# EAGLE design fri3d-badge-2018 (EAGLE 8.6.0)
CNAME: Fri3d Camp Badge; CREVISION: 2.0; DESIGNER: Christophe VG

## Sheet 1 of 2
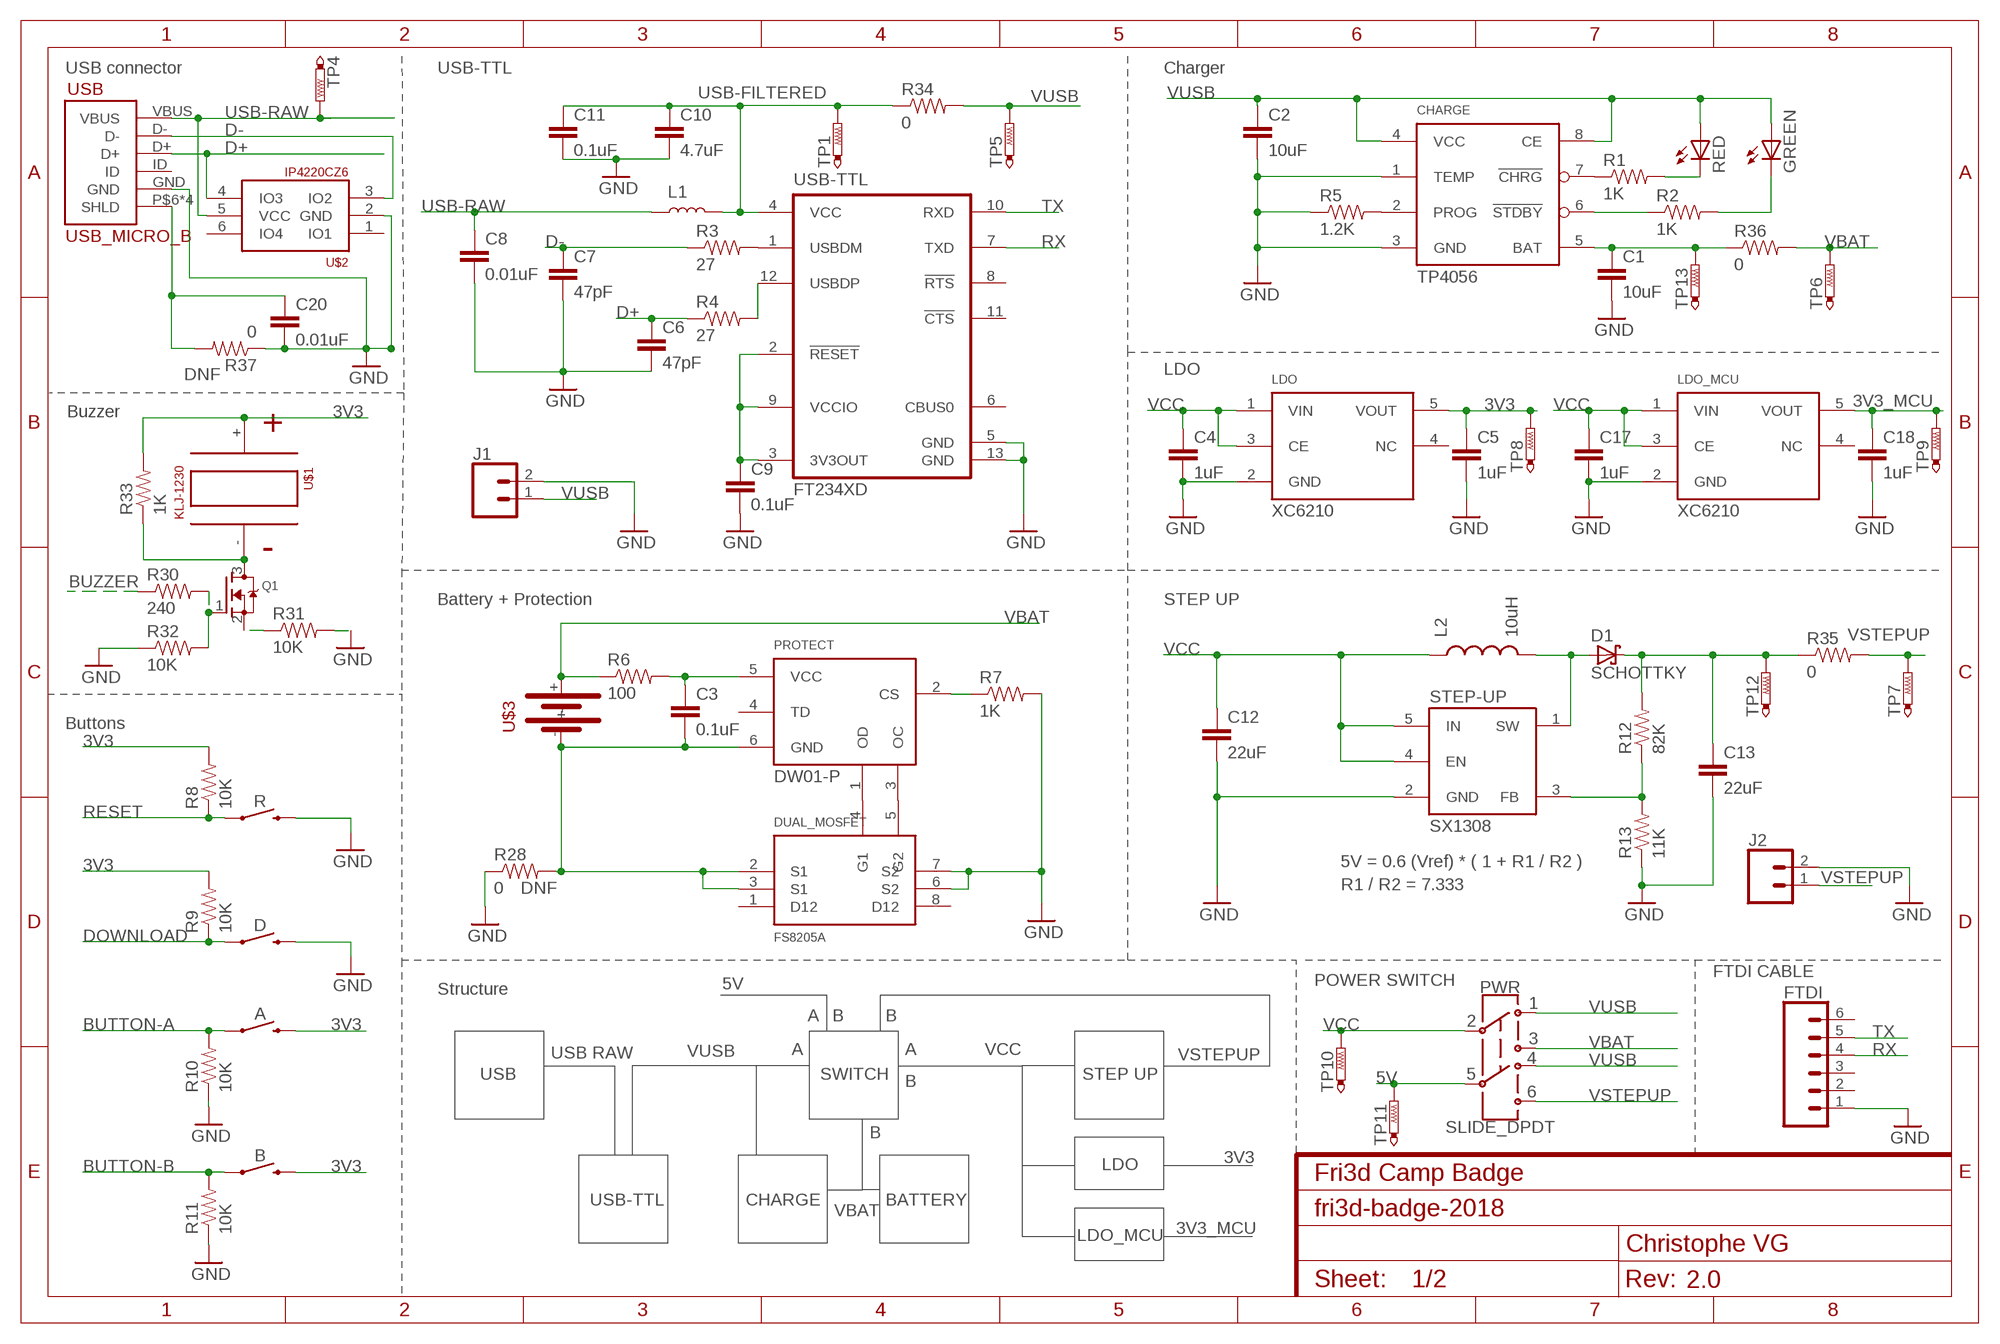
[diagram p0: schematic, sheet 1]

### Parts
A  SWITCH-MOMENTARY-4.5MM  [SWITCH-MOMENTARY-4.5MM]
B  SWITCH-MOMENTARY-4.5MM  [SWITCH-MOMENTARY-4.5MM]
C1  10uF  CAP0805  [0805]
C2  10uF  CAP0805  [0805]
C3  0.1uF  CAP0805  [0805]
C4  1uF  CAP0805  [0805]
C5  1uF  CAP0805  [0805]
C6  47pF  CAP0805  [0805]
C7  47pF  CAP0805  [0805]
C8  0.01uF  CAP0805  [0805]
C9  0.1uF  CAP0805  [0805]
C10  4.7uF  CAP0805  [0805]
C11  0.1uF  CAP0805  [0805]
C12  22uF  CAP0805  [0805]
C13  22uF  CAP0805  [0805]
C17  1uF  CAP0805  [0805]
C18  1uF  CAP0805  [0805]
C20  0.01uF  CAP0805  [0805]
CHARGE  TP4056  [SO8]
D  SWITCH-MOMENTARY-4.5MM  [SWITCH-MOMENTARY-4.5MM]
D1  SCHOTTKY  [SOD993]
DUAL_MOSFET  FS8205A  [TSSOP8]
FTDI  CONN_06SILK_FEMALE_PTH  [1X06]
GREEN  LEDCHIP-LED0805  [CHIP-LED0805]
J1  CONN_02  [1X02]
J2  CONN_02  [1X02]
L1  INDUCTOR-0805-3.3UH  [0805]
L2  10uH  TYS6045100M-10  [TYS6045]
LDO  XC6210  [SOT23-5]
LDO_MCU  XC6210  [SOT23-5]
PROTECT  DW01-P  [SOT23-6]
PWR  SLIDE_DPDT  [SLIDE_SWITCH]
Q1  MOSFET-NREFLOW  [SOT23]
R  SWITCH-MOMENTARY-4.5MM  [SWITCH-MOMENTARY-4.5MM]
R1  1K  RESISTOR0805-RES  [0805]
R2  1K  RESISTOR0805-RES  [0805]
R3  27  RESISTOR0805-RES  [0805]
R4  27  RESISTOR0805-RES  [0805]
R5  1.2K  RESISTOR0805-RES  [0805]
R6  100  RESISTOR0805-RES  [0805]
R7  1K  RESISTOR0805-RES  [0805]
R8  10K  RESISTOR0805-RES  [0805]
R9  10K  RESISTOR0805-RES  [0805]
R10  10K  RESISTOR0805-RES  [0805]
R11  10K  RESISTOR0805-RES  [0805]
R12  82K  RESISTOR0805-RES  [0805]
R13  11K  RESISTOR0805-RES  [0805]
R28  0  RESISTOR0805-RES  [0805]
R30  240  RESISTOR0805-RES  [0805]
R31  10K  RESISTOR0805-RES  [0805]
R32  10K  RESISTOR0805-RES  [0805]
R33  1K  RESISTOR0805-RES  [0805]
R34  0  RESISTOR0805-RES  [0805]
R35  0  RESISTOR0805-RES  [0805]
R36  0  RESISTOR0805-RES  [0805]
R37  0  RESISTOR0805-RES  [0805]
RED  LEDCHIP-LED0805  [CHIP-LED0805]
STEP-UP  SX1308  [SOT23-6]
TP1  PTR1B1,27  [B1,27]
TP4  PTR1B1,27  [B1,27]
TP5  PTR1B1,27  [B1,27]
TP6  PTR1B1,27  [B1,27]
TP7  PTR1B1,27  [B1,27]
TP8  PTR1B1,27  [B1,27]
TP9  PTR1B1,27  [B1,27]
TP10  PTR1B1,27  [B1,27]
TP11  PTR1B1,27  [B1,27]
TP12  PTR1B1,27  [B1,27]
TP13  PTR1B1,27  [B1,27]
U$1  KLJ-1230  [KLJ-1230]
U$2  IP4220CZ6  [SOT457R_PHILIPS]
U$3  CR18650  [BATTERY_HOLDER_18650]
USB  USB_MICRO_B  [USB_MICRO_B]
USB-TTL  FT234XD  [DFN12]

### Nets
3V3: A.3 A.4 B.3 B.4 C5.1 LDO.5(VOUT) R8.2 R9.2 R33.2 TP8.TP U$1.+ ; also sheet 2
3V3_MCU: C18.1 LDO_MCU.5(VOUT) TP9.TP ; also sheet 2
5V: PWR.5 TP11.TP ; also sheet 2
BUTTON-A: A.1 A.2 R10.2 ; also sheet 2
BUTTON-B: B.1 B.2 R11.2 ; also sheet 2
BUZZER: R30.1 ; also sheet 2
D+: C6.1 R4.1 U$2.4(IO3) USB.D+
D-: C7.1 R3.1 U$2.3(IO2) USB.D-
DOWNLOAD: D.1 D.2 R9.1 ; also sheet 2
GND: C1.2 C2.2 C4.2 C5.2 C6.2 C7.2 C8.2 C9.2 C10.2 C11.2 C12.2 C13.2 C17.2 C18.2 C20.2 CHARGE.1(TEMP) CHARGE.3(GND) D.3 D.4 DUAL_MOSFET.6(S2) DUAL_MOSFET.7(S2) FTDI.1 J1.2 J2.2 LDO.2(GND) LDO_MCU.2(GND) R5.1 R7.2 R10.1 R11.1 R13.1 R28.1 R31.2 R32.1 R37.1 R.3 R.4 STEP-UP.2(GND) U$2.2(GND) USB-TTL.5(GND) USB-TTL.13(GND) USB.GND ; also sheet 2
N$1: C13.1 D1.P$2(C) R12.2 R35.1 TP12.TP
N$2: Q1.3(D) R33.1 U$1.-
N$3: R3.2 USB-TTL.1(USBDM)
N$4: CHARGE.7(!CHRG!) R1.1
N$5: R4.2 USB-TTL.12(USBDP)
N$6: C9.1 USB-TTL.2(!RESET!) USB-TTL.3(3V3OUT) USB-TTL.9(VCCIO)
N$7: CHARGE.6(!STDBY!) R2.1
N$8: R1.2 RED.C
N$9: GREEN.C R2.2
N$10: CHARGE.2(PROG) R5.2
N$11: Q1.1(G) R30.2 R32.2
N$12: PROTECT.2(CS) R7.1
N$13: C3.1 PROTECT.5(VCC) R6.2
N$14: DUAL_MOSFET.4(G1) PROTECT.1(OD)
N$15: DUAL_MOSFET.5(G2) PROTECT.3(OC)
N$18: R12.1 R13.2 STEP-UP.3(FB)
N$19: D1.P$1(A) L2.P$2 STEP-UP.1(SW)
N$22: C1.1 CHARGE.5(BAT) R36.1 TP13.TP
N$23: C20.1 R37.2 USB.P$6(SHLD) USB.P$7(SHLD) USB.P$8(SHLD) USB.P$9(SHLD)
N$62: C3.2 DUAL_MOSFET.2(S1) DUAL_MOSFET.3(S1) PROTECT.6(GND) R28.2 U$3.-
N$63: Q1.2(S) R31.1
RESET: R8.1 R.1 R.2 ; also sheet 2
RX: FTDI.4 USB-TTL.7(TXD) ; also sheet 2
TX: FTDI.5 USB-TTL.10(RXD) ; also sheet 2
USB-FILTERED: C10.1 C11.1 L1.2 R34.1 TP1.TP USB-TTL.4(VCC)
USB-RAW: C8.1 L1.1 TP4.TP U$2.5(VCC) USB.VBUS
VBAT: PWR.3 R6.1 R36.2 TP6.TP U$3.+
VCC: C4.1 C12.1 C17.1 L2.P$1 LDO.1(VIN) LDO.3(CE) LDO_MCU.1(VIN) LDO_MCU.3(CE) PWR.2 STEP-UP.4(EN) STEP-UP.5(IN) TP10.TP
VSTEPUP: J2.1 PWR.4 R35.2 TP7.TP
VUSB: C2.1 CHARGE.4(VCC) CHARGE.8(CE) GREEN.A J1.1 PWR.1 PWR.8 R34.2 RED.A TP5.TP
Unconnected: DUAL_MOSFET.1(D12) DUAL_MOSFET.8(D12) FTDI.2 FTDI.3 FTDI.6 LDO.4(NC) LDO_MCU.4(NC) PROTECT.4(TD) U$2.1(IO1) U$2.6(IO4) USB-TTL.6(CBUS0) USB-TTL.8(!RTS!) USB-TTL.11(!CTS!) USB.ID

### Notes on the sheet
- USB connector | USB-TTL | Charger
- LDO
- DNF
- Buzzer
- Battery + Protection | STEP UP
- Buttons
- 5V = 0.6 (Vref) * ( 1 + R1 / R2 )
- DNF | R1 / R2 = 7.333
- FTDI CABLE
- 5V | POWER SWITCH
- Structure
- A | B | B
- USB RAW | VUSB | A | A | VCC
- VSTEPUP
- USB | SWITCH | STEP UP
- B
- B
- 3V3
- LDO
- USB-TTL | CHARGE | BATTERY
- VBAT
- 3V3_MCU
- LDO_MCU

## Sheet 2 of 2
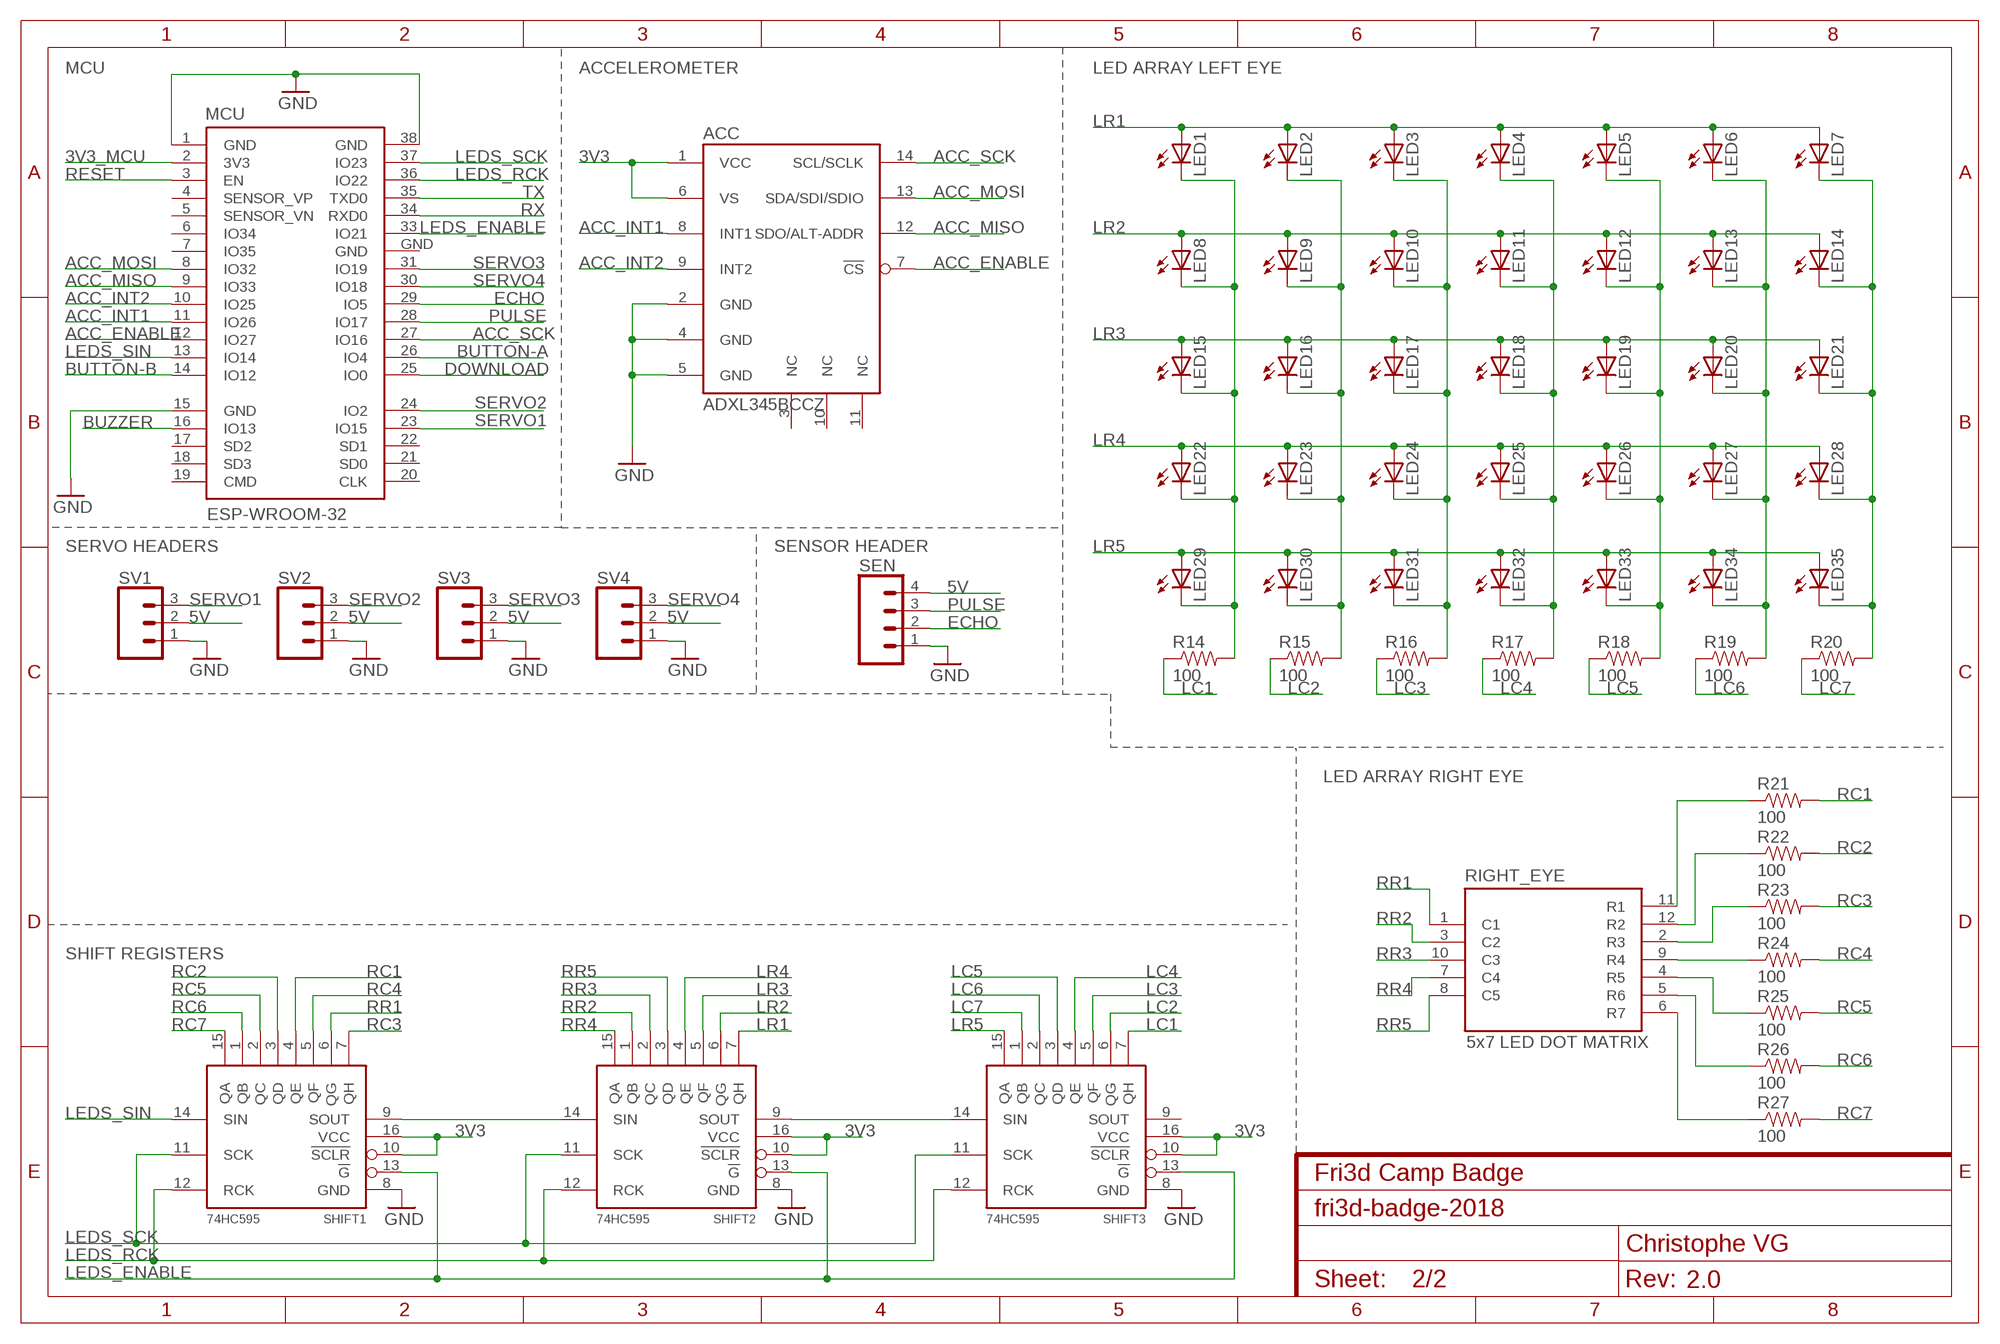
[diagram p1: schematic, sheet 2]

### Parts
ACC  ADXL345BCCZ  [LGA]
LED1  LEDCHIP-LED0805  [CHIP-LED0805]
LED2  LEDCHIP-LED0805  [CHIP-LED0805]
LED3  LEDCHIP-LED0805  [CHIP-LED0805]
LED4  LEDCHIP-LED0805  [CHIP-LED0805]
LED5  LEDCHIP-LED0805  [CHIP-LED0805]
LED6  LEDCHIP-LED0805  [CHIP-LED0805]
LED7  LEDCHIP-LED0805  [CHIP-LED0805]
LED8  LEDCHIP-LED0805  [CHIP-LED0805]
LED9  LEDCHIP-LED0805  [CHIP-LED0805]
LED10  LEDCHIP-LED0805  [CHIP-LED0805]
LED11  LEDCHIP-LED0805  [CHIP-LED0805]
LED12  LEDCHIP-LED0805  [CHIP-LED0805]
LED13  LEDCHIP-LED0805  [CHIP-LED0805]
LED14  LEDCHIP-LED0805  [CHIP-LED0805]
LED15  LEDCHIP-LED0805  [CHIP-LED0805]
LED16  LEDCHIP-LED0805  [CHIP-LED0805]
LED17  LEDCHIP-LED0805  [CHIP-LED0805]
LED18  LEDCHIP-LED0805  [CHIP-LED0805]
LED19  LEDCHIP-LED0805  [CHIP-LED0805]
LED20  LEDCHIP-LED0805  [CHIP-LED0805]
LED21  LEDCHIP-LED0805  [CHIP-LED0805]
LED22  LEDCHIP-LED0805  [CHIP-LED0805]
LED23  LEDCHIP-LED0805  [CHIP-LED0805]
LED24  LEDCHIP-LED0805  [CHIP-LED0805]
LED25  LEDCHIP-LED0805  [CHIP-LED0805]
LED26  LEDCHIP-LED0805  [CHIP-LED0805]
LED27  LEDCHIP-LED0805  [CHIP-LED0805]
LED28  LEDCHIP-LED0805  [CHIP-LED0805]
LED29  LEDCHIP-LED0805  [CHIP-LED0805]
LED30  LEDCHIP-LED0805  [CHIP-LED0805]
LED31  LEDCHIP-LED0805  [CHIP-LED0805]
LED32  LEDCHIP-LED0805  [CHIP-LED0805]
LED33  LEDCHIP-LED0805  [CHIP-LED0805]
LED34  LEDCHIP-LED0805  [CHIP-LED0805]
LED35  LEDCHIP-LED0805  [CHIP-LED0805]
MCU  ESP-WROOM-32  [ESP-WROOM-32]
R14  100  RESISTOR0805-RES  [0805]
R15  100  RESISTOR0805-RES  [0805]
R16  100  RESISTOR0805-RES  [0805]
R17  100  RESISTOR0805-RES  [0805]
R18  100  RESISTOR0805-RES  [0805]
R19  100  RESISTOR0805-RES  [0805]
R20  100  RESISTOR0805-RES  [0805]
R21  100  RESISTOR0805-RES  [0805]
R22  100  RESISTOR0805-RES  [0805]
R23  100  RESISTOR0805-RES  [0805]
R24  100  RESISTOR0805-RES  [0805]
R25  100  RESISTOR0805-RES  [0805]
R26  100  RESISTOR0805-RES  [0805]
R27  100  RESISTOR0805-RES  [0805]
RIGHT_EYE  5x7 LED DOT MATRIX  5X7_DOT_LED_MATRIX  [5X7_DOT_LED_MATRIX]
SEN  CONN_04  [1X04]
SHIFT1  74HC595  [SO16]
SHIFT2  74HC595  [SO16]
SHIFT3  74HC595  [SO16]
SV1  CONN_03  [1X03]
SV2  CONN_03  [1X03]
SV3  CONN_03  [1X03]
SV4  CONN_03  [1X03]

### Nets
3V3: ACC.1(VCC) ACC.6(VS) SHIFT1.10(!SCLR) SHIFT1.16(VCC) SHIFT2.10(!SCLR) SHIFT2.16(VCC) SHIFT3.10(!SCLR) SHIFT3.16(VCC) ; also sheet 1
3V3_MCU: MCU.2(3V3) ; also sheet 1
5V: SEN.4 SV1.2 SV2.2 SV3.2 SV4.2 ; also sheet 1
ACC_ENABLE: ACC.7(!CS!) MCU.12(IO27)
ACC_INT1: ACC.8(INT1) MCU.11(IO26)
ACC_INT2: ACC.9(INT2) MCU.10(IO25)
ACC_MISO: ACC.12(SDO/ALT-ADDR) MCU.9(IO33)
ACC_MOSI: ACC.13(SDA/SDI/SDIO) MCU.8(IO32)
ACC_SCK: ACC.14(SCL/SCLK) MCU.27(IO16)
BUTTON-A: MCU.26(IO4) ; also sheet 1
BUTTON-B: MCU.14(IO12) ; also sheet 1
BUZZER: MCU.16(IO13) ; also sheet 1
DOWNLOAD: MCU.25(IO0) ; also sheet 1
ECHO: MCU.29(IO5) SEN.2
GND: ACC.2(GND) ACC.4(GND) ACC.5(GND) MCU.1(GND) MCU.15(GND) MCU.38(GND) SEN.1 SHIFT1.8(GND) SHIFT2.8(GND) SHIFT3.8(GND) SV1.1 SV2.1 SV3.1 SV4.1 ; also sheet 1
LC1: R14.1 SHIFT3.7(QH)
LC2: R15.1 SHIFT3.6(QG)
LC3: R16.1 SHIFT3.5(QF)
LC4: R17.1 SHIFT3.4(QE)
LC5: R18.1 SHIFT3.3(QD)
LC6: R19.1 SHIFT3.2(QC)
LC7: R20.1 SHIFT3.1(QB)
LEDS_ENABLE: MCU.33(IO21) SHIFT1.13(!G) SHIFT2.13(!G) SHIFT3.13(!G)
LEDS_RCK: MCU.36(IO22) SHIFT1.12(RCK) SHIFT2.12(RCK) SHIFT3.12(RCK)
LEDS_SCK: MCU.37(IO23) SHIFT1.11(SCK) SHIFT2.11(SCK) SHIFT3.11(SCK)
LEDS_SIN: MCU.13(IO14) SHIFT1.14(SIN)
LR1: LED1.A LED2.A LED3.A LED4.A LED5.A LED6.A LED7.A SHIFT2.7(QH)
LR2: LED8.A LED9.A LED10.A LED11.A LED12.A LED13.A LED14.A SHIFT2.6(QG)
LR3: LED15.A LED16.A LED17.A LED18.A LED19.A LED20.A LED21.A SHIFT2.5(QF)
LR4: LED22.A LED23.A LED24.A LED25.A LED26.A LED27.A LED28.A SHIFT2.4(QE)
LR5: LED29.A LED30.A LED31.A LED32.A LED33.A LED34.A LED35.A SHIFT3.15(QA)
N$20: SHIFT1.9(SOUT) SHIFT2.14(SIN)
N$21: SHIFT2.9(SOUT) SHIFT3.14(SIN)
N$30: R21.1 RIGHT_EYE.11(R1)
N$31: R22.1 RIGHT_EYE.12(R2)
N$32: LED1.C LED8.C LED15.C LED22.C LED29.C R14.2
N$33: LED2.C LED9.C LED16.C LED23.C LED30.C R15.2
N$34: LED3.C LED10.C LED17.C LED24.C LED31.C R16.2
N$35: LED4.C LED11.C LED18.C LED25.C LED32.C R17.2
N$36: LED5.C LED12.C LED19.C LED26.C LED33.C R18.2
N$37: LED6.C LED13.C LED20.C LED27.C LED34.C R19.2
N$38: LED7.C LED14.C LED21.C LED28.C LED35.C R20.2
N$39: R24.1 RIGHT_EYE.9(R4)
N$40: R23.1 RIGHT_EYE.2(R3)
N$41: R25.1 RIGHT_EYE.4(R5)
N$42: R26.1 RIGHT_EYE.5(R6)
N$43: R27.1 RIGHT_EYE.6(R7)
PULSE: MCU.28(IO17) SEN.3
RC1: R21.2 SHIFT1.4(QE)
RC2: R22.2 SHIFT1.3(QD)
RC3: R23.2 SHIFT1.7(QH)
RC4: R24.2 SHIFT1.5(QF)
RC5: R25.2 SHIFT1.2(QC)
RC6: R26.2 SHIFT1.1(QB)
RC7: R27.2 SHIFT1.15(QA)
RESET: MCU.3(EN) ; also sheet 1
RR1: RIGHT_EYE.1(C1) SHIFT1.6(QG)
RR2: RIGHT_EYE.3(C2) SHIFT2.1(QB)
RR3: RIGHT_EYE.10(C3) SHIFT2.2(QC)
RR4: RIGHT_EYE.7(C4) SHIFT2.15(QA)
RR5: RIGHT_EYE.8(C5) SHIFT2.3(QD)
RX: MCU.34(RXD0) ; also sheet 1
SERVO1: MCU.23(IO15) SV1.3
SERVO2: MCU.24(IO2) SV2.3
SERVO3: MCU.31(IO19) SV3.3
SERVO4: MCU.30(IO18) SV4.3
TX: MCU.35(TXD0) ; also sheet 1
Unconnected: ACC.3(NC) ACC.10(NC) ACC.11(NC) MCU.4(SENSOR_VP) MCU.5(SENSOR_VN) MCU.6(IO34) MCU.7(IO35) MCU.17(SD2) MCU.18(SD3) MCU.19(CMD) MCU.20(CLK) MCU.21(SD0) MCU.22(SD1) SHIFT3.9(SOUT)

### Notes on the sheet
- MCU | ACCELEROMETER | LED ARRAY LEFT EYE
- SERVO HEADERS | SENSOR HEADER
- LED ARRAY RIGHT EYE
- SHIFT REGISTERS

## Power pins joined to a net without a drawn wire
GND: MCU.GND

## Library data of the parts
A B D R = switches:SWITCH-MOMENTARY-4.5MM
ACC = ic:ADXL345BCCZ
C1-C13 C17 C18 C20 = passive:CAP: Capacitor Standard 0603 ceramic capacitor, and 0.1" leaded capacitor.
CHARGE = power:TP4056
D1 = passive:SCHOTTKY
DUAL_MOSFET = ic:FS8205A
FTDI = SparkFun-Connectors:CONN_06: Multi connection point. Often used as Generic Header-pin footprint for 0.1 inch spaced/style header connections On any of the 0.1 inch spaced packages, you can populate with these: Break Away Headers - Straight <https://www.sparkfun.com/products/116> (PRT-00116) Break Away Male Headers - Right Angle <https://www.sparkfun.com/products/553> (PRT-00553) Female Headers <https://www.sparkfun.com/products/115> (PRT-00115) Break Away Headers - Machine Pin <https://www.sparkfun.com/products/117> (PRT-00117) Break Away Female Headers - Swiss Machine Pin <https://www.sparkfun.com/products/743> (PRT-00743) Arduino Stackable Header - 6 Pin <https://www.sparkfun.com/products/9280> (PRT-09280) For SCREWTERMINALS and SPRING TERMINALS visit here: Screw Terimnals on SparkFun.com <https://www.sparkfun.com/search/results?term=Screw+Terminals> (5mm/3.5mm/2.54mm spacing) This device is also useful as a general connection point to wire up your design to another part of your project. Our various solder wires solder well into these plated through hole pads. Hook-Up Wire - Assortment (Stranded, 22 AWG) <https://www.sparkfun.com/products/11375> (PRT-11375) Hook-Up Wire - Assortment (Solid Core, 22 AWG) <https://www.sparkfun.com/products/11367> (PRT-11367) View the entire wire category on our website here <https://www.sparkfun.com/categories/141>; PROD_ID: CONN-08437
GREEN LED1-LED35 RED = led:LED: LED OSRAM: - CHIPLED LG R971, LG N971, LY N971, LG Q971, LY Q971, LO R971, LY R971 LH N974, LH R974 LS Q976, LO Q976, LY Q976 LO Q996 - Hyper CHIPLED LW Q18S LB Q993, LB Q99A, LB R99A - SideLED LS A670, LO A670, LY A670, LG A670, LP A670 LB A673, LV A673, LT A673, LW A673 LH A674 LY A675 LS A676, LA A676, LO A676, LY A676, LW A676 LS A679, LY A679, LG A679 - Hyper Micro SIDELED® LS Y876, LA Y876, LO Y876, LY Y876 LT Y87S - SmartLED LW L88C, LW L88S LB L89C, LB L89S, LG L890 LS L89K, LO L89K, LY L89K LS L896, LA L896, LO L896, LY L896 - TOPLED LS T670, LO T670, LY T670, LG T670, LP T670 LSG T670, LSP T670, LSY T670, LOP T670, LYG T670 LG T671, LOG T671, LSG T671 LB T673, LV T673, LT T673, LW T673 LH T674 LS T676, LA T676, LO T676, LY T676, LB T676, LH T676, LSB T676, LW T676 LB T67C, LV T67C, LT T67C, LS T67K, LO T67K, LY T67K, LW E67C LS E67B, LA E67B, LO E67B, LY E67B, LB E67C, LV E67C, LT E67C LW T67C LS T679, LY T679, LG T679 LS T770, LO T770, LY T770, LG T770, LP T770 LB T773, LV T773, LT T773, LW T773 LH T774 LS E675, LA E675, LY E675, LS T675 LS T776, LA T776, LO T776, LY T776, LB T776 LHGB T686 LT T68C, LB T68C - Hyper Mini TOPLED® LB M676 - Mini TOPLED Santana® LG M470 LS M47K, LO M47K, LY M47K Source: http://www.osram.convergy.de/
J1 J2 = SparkFun-Connectors:CONN_02: Multi connection point. Often used as Generic Header-pin footprint for 0.1 inch spaced/style header connections On any of the 0.1 inch spaced packages, you can populate with these: Break Away Headers - Straight <https://www.sparkfun.com/products/116> (PRT-00116) Break Away Male Headers - Right Angle <https://www.sparkfun.com/products/553> (PRT-00553) Female Headers <https://www.sparkfun.com/products/115> (PRT-00115) Break Away Headers - Machine Pin <https://www.sparkfun.com/products/117> (PRT-00117) Break Away Female Headers - Swiss Machine Pin <https://www.sparkfun.com/products/743> (PRT-00743) For SCREWTERMINALS and SPRING TERMINALS visit here: Screw Terimnals on SparkFun.com <https://www.sparkfun.com/search/results?term=Screw+Terminals> (5mm/3.5mm/2.54mm spacing) This device is also useful as a general connection point to wire up your design to another part of your project. Our various solder wires solder well into these plated through hole pads. Hook-Up Wire - Assortment (Stranded, 22 AWG) <https://www.sparkfun.com/products/11375> (PRT-11375) Hook-Up Wire - Assortment (Solid Core, 22 AWG) <https://www.sparkfun.com/products/11367> (PRT-11367) View the entire wire category on our website here <https://www.sparkfun.com/categories/141> Special notes: Molex polarized connector foot print use with: PRT-08233 with associated crimp pins and housings. 2.54_SCREWTERM for use with PRT-10571. 3.5mm Screw Terminal footprints for PRT-08084 5mm Screw Terminal footprints for use with PRT-08432
L1 = SparkFun-Coils:INDUCTOR: Inductors Resist changes in electrical current. Basically a coil of wire. SparkFun Products: SparkFun Load Cell Amplifier - HX711 <https://www.sparkfun.com/products/13879> IOIO-OTG - V2.2 <https://www.sparkfun.com/products/13613>; PROD_ID: NDUC-13076; VALUE: 3.3µH/±20%/450mA
L2 = passive:TYS6045100M-10
LDO LDO_MCU = power:XC6210
MCU = esp32:ESP-WROOM-32: Espressif Systems ESP-WROOM-32
PROTECT = power:DW01-P
PWR = switches:SLIDE_DPDT
Q1 = mosfet:MOSFET-N: N-Channel Mosfet 2N7002E - 60V 260mA SOT23 [Digikey: 2N7002ET1GOSTR-ND] - REEL BSH103 - 30V 850mA SOT23 [Digikey: 568-5013-1-ND]
R1-R28 R30-R37 = passive:RESISTOR: Resistor Basic schematic elements and footprints for 0603, 1206, and PTH resistors.
RIGHT_EYE = led:5X7_DOT_LED_MATRIX
SEN = SparkFun-Connectors:CONN_04: Multi connection point. Often used as Generic Header-pin footprint for 0.1 inch spaced/style header connections On any of the 0.1 inch spaced packages, you can populate with these: Break Away Headers - Straight <https://www.sparkfun.com/products/116> (PRT-00116) Break Away Male Headers - Right Angle <https://www.sparkfun.com/products/553> (PRT-00553) Female Headers <https://www.sparkfun.com/products/115> (PRT-00115) Break Away Headers - Machine Pin <https://www.sparkfun.com/products/117> (PRT-00117) Break Away Female Headers - Swiss Machine Pin <https://www.sparkfun.com/products/743> (PRT-00743) For SCREWTERMINALS and SPRING TERMINALS visit here: Screw Terimnals on SparkFun.com <https://www.sparkfun.com/search/results?term=Screw+Terminals> (5mm/3.5mm/2.54mm spacing) This device is also useful as a general connection point to wire up your design to another part of your project. Our various solder wires solder well into these plated through hole pads. Hook-Up Wire - Assortment (Stranded, 22 AWG) <https://www.sparkfun.com/products/11375> (PRT-11375) Hook-Up Wire - Assortment (Solid Core, 22 AWG) <https://www.sparkfun.com/products/11367> (PRT-11367) View the entire wire category on our website here <https://www.sparkfun.com/categories/141> Special notes: Molex polarized connector foot print use with SKU : PRT-08231 with associated crimp pins and housings. 1MM SMD Version SKU: PRT-10208; PROD_ID: CONN-09696
SHIFT1-SHIFT3 = ic:74HC595
STEP-UP = power:SX1308
SV1-SV4 = SparkFun-Connectors:CONN_03: Multi connection point. Often used as Generic Header-pin footprint for 0.1 inch spaced/style header connections On any of the 0.1 inch spaced packages, you can populate with these: Break Away Headers - Straight <https://www.sparkfun.com/products/116> (PRT-00116) Break Away Male Headers - Right Angle <https://www.sparkfun.com/products/553> (PRT-00553) Female Headers <https://www.sparkfun.com/products/115> (PRT-00115) Break Away Headers - Machine Pin <https://www.sparkfun.com/products/117> (PRT-00117) Break Away Female Headers - Swiss Machine Pin <https://www.sparkfun.com/products/743> (PRT-00743) Stackable Header - 3 Pin (Female, 0.1") <https://www.sparkfun.com/products/13875> (PRT-13875) For SCREWTERMINALS and SPRING TERMINALS visit here: Screw Terimnals on SparkFun.com <https://www.sparkfun.com/search/results?term=Screw+Terminals> (5mm/3.5mm/2.54mm spacing) This device is also useful as a general connection point to wire up your design to another part of your project. Our various solder wires solder well into these plated through hole pads. Hook-Up Wire - Assortment (Stranded, 22 AWG) <https://www.sparkfun.com/products/11375> (PRT-11375) Hook-Up Wire - Assortment (Solid Core, 22 AWG) <https://www.sparkfun.com/products/11367> (PRT-11367) View the entire wire category on our website here <https://www.sparkfun.com/categories/141> Special notes: Molex polarized connector foot print use with SKU : PRT-08232 with associated crimp pins and housings.
TP1 TP4-TP13 = testpad:PTR1: TEST PIN
U$1 = sound:KLJ-1230
U$2 = ic:IP4220CZ6
U$3 = setup:CR18650
USB = connector:USB_MICRO_B
USB-TTL = ftdi-chip:FT234XD: USB TO BASIC UART IC

## Board
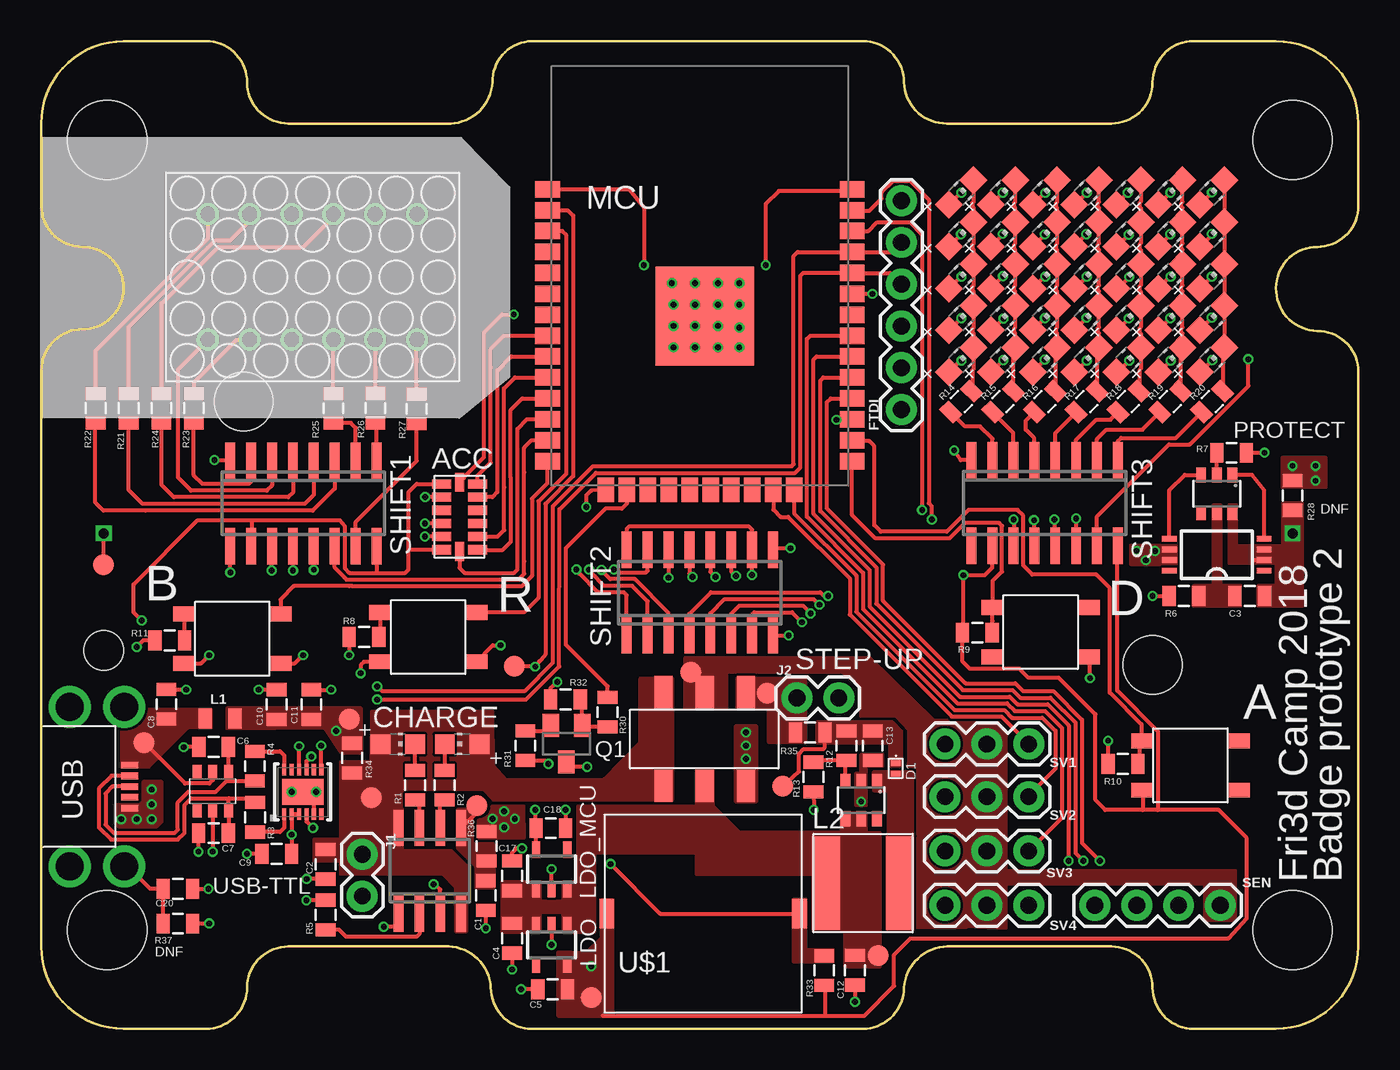
[diagram p2: board, top side]
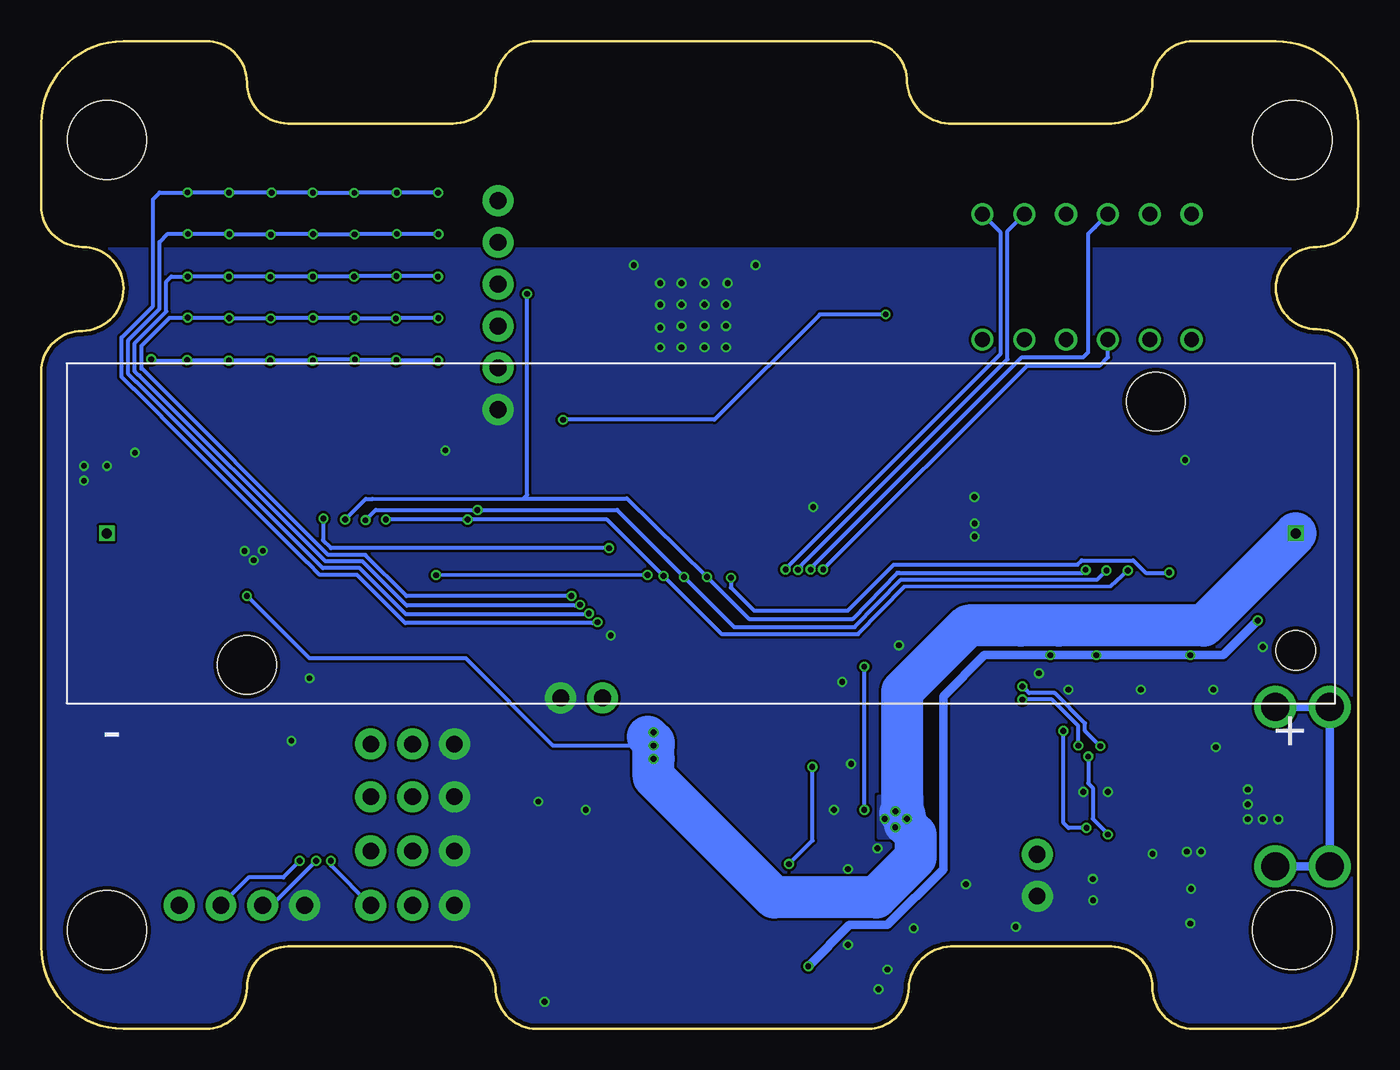
[diagram p3: board, bottom side, seen from below]

Size 80.01 x 60 mm. Coordinates in mm from the lower left corner, seen from the top.
Outline: 0.01,55 arc-90 5.01,60 10.01,60 arc-90 12.51,57.5 arc90 15.01,55 24.61,55 arc90 27.41,57.5 arc-90 29.81,60 49.91,60 arc-90 52.41,57.5 arc90 55.01,55 65.01,55 arc90 67.51,57.5 arc-90 70.01,60 75.01,60 arc-90 80.01,55 80.01,50 arc-90 77.51,47.5 arc90 75.01,45 arc90 77.51,42.4 arc-90 80.01,39.9 80.01,5 arc-90 75.01,0 70.01,0 arc-90 67.51,2.5 arc90 65.01,5 55.31,5 arc90 52.41,2.5 arc-90 49.91,0 29.81,0 arc-90 27.31,2.5 arc90 24.51,5 15.01,5 arc90 12.51,2.5 arc-90 10.01,0 5.01,0 arc-90 0.01,5 0.01,40 arc-90 2.51,42.5 arc90 5.01,45 arc90 2.51,47.5 arc-90 0.01,50 0.01,55
Copper layers (1*16): Top 0.018mm / dielectric 1.55mm / Bottom 0.018mm
Design rules "eC_2Layer_PClass6_BaseCopperO18_eCDefault": minimum track width 0.15mm, minimum drill 0.35mm, track to track 0.15mm, track to pad 0.15mm, pad to pad 0.15mm, via to via 0.15mm, smd to smd 0mil, copper to edge 0.25mm, drill to drill 0.35mm, minimum pad ring 0.175mm, minimum via ring 0.125mm, stop-mask expansion 0mil, vias tented up to drill 0.45mm, thermal gap 0.2mm
Holes 4.8 mm at 4.01,54 76.01,54 4.01,6 76.01,6

### Footprints (pad centres in the part's own frame; a part is rotated, then mirrored left to right if it is on the bottom)
SWITCH-MOMENTARY-4.5MM = smd 1.35 x 0.9: 1 -2.925,1.5; 2 2.925,1.5; 3 -2.925,-1.5; 4 2.925,-1.5
LGA = smd 1.145 x 0.55: 1 -1.097,2; 2 -1.097,1.2; 3 -1.097,0.4; 4 -1.097,-0.4; 5 -1.097,-1.2; 6 -1.097,-2; 8 1.097,-2; 9 1.097,-1.2; 10 1.097,-0.4; 11 1.097,0.4; 12 1.097,1.2; 13 1.097,2 | smd 0.55 x 1.145: 7 0,-2.098; 14 0,2.098
0805 = smd 0.8 x 1.2: 1 -0.9,0; 2 0.9,0
SO8 = smd 0.6 x 2.2: 1 -1.905,-2.6; 2 -0.635,-2.6; 3 0.635,-2.6; 4 1.905,-2.6; 5 1.905,2.6; 6 0.635,2.6; 7 -0.635,2.6; 8 -1.905,2.6
SOD993 = smd 0.35 x 0.6: P$1 -0.325,0; P$2 0.325,0
TSSOP8 = smd 0.9 x 0.35: 1 -2.875,0.975; 2 -2.875,0.325; 3 -2.875,-0.325; 4 -2.875,-0.975; 5 2.875,-0.975; 6 2.875,-0.325; 7 2.875,0.325; 8 2.875,0.975
1X06 = drill 1.016 pad 1.88: 1 0,0; 2 2.54,0; 3 5.08,0; 4 7.62,0; 5 10.16,0; 6 12.7,0
CHIP-LED0805 = smd 1.2 x 1.2: A 0,-1.05; C 0,1.05
1X02 = drill 1.016 pad 1.88: 1 0,0; 2 2.54,0
TYS6045 = smd 1.7 x 5.7: P$1 -2.25,0; P$2 2.25,0
SOT23-5 = smd 0.5 x 1: 1 -0.95,-1.2; 2 0,-1.2; 3 0.95,-1.2; 4 0.95,1.2; 5 -0.95,1.2
ESP-WROOM-32 = smd 1.5 x 1: 1 -9.25,7; 2 -9.25,5.73; 3 -9.25,4.46; 4 -9.25,3.19; 5 -9.25,1.92; 6 -9.25,0.65; 7 -9.25,-0.62; 8 -9.25,-1.89; 9 -9.25,-3.16; 10 -9.25,-4.43; 11 -9.25,-5.7; 12 -9.25,-6.97; 13 -9.25,-8.24; 14 -9.25,-9.51; 25 9.25,-9.51; 26 9.25,-8.24; 27 9.25,-6.97; 28 9.25,-5.7; 29 9.25,-4.43; 30 9.25,-3.16; 31 9.25,-1.89; 32 9.25,-0.62; 33 9.25,0.65; 34 9.25,1.92; 35 9.25,3.19; 36 9.25,4.46; 37 9.25,5.73; 38 9.25,7 | smd 1 x 1.5: 15 -5.7,-11.25; 16 -4.43,-11.25; 17 -3.16,-11.25; 18 -1.89,-11.25; 19 -0.62,-11.25; 20 0.65,-11.25; 21 1.92,-11.25; 22 3.19,-11.25; 23 4.46,-11.25; 24 5.73,-11.25 | smd 6 x 6: GND 0.3,-0.7
SOT23-6 = smd 0.6 x 0.9: 1 -0.95,-1.15; 2 0,-1.15; 3 0.95,-1.15; 4 0.95,1.15; 5 0,1.15; 6 -0.95,1.15
SLIDE_SWITCH = smd 1.1 x 1.95: 1 -2.5,-2.85; 2 0,-2.85; 3 2.5,-2.85; 4 2.5,2.85; 5 0,2.85; 8 -2.5,2.85
SOT23 = smd 1 x 1.4: 1 -0.95,-1.1; 2 0.95,-1.1; 3 0,1.1
5X7_DOT_LED_MATRIX = drill 0.9: 1 -3.81,6.35; 2 -3.81,3.81; 3 -3.81,1.27; 4 -3.81,-1.27; 5 -3.81,-3.81; 6 -3.81,-6.35; 7 3.81,-6.35; 8 3.81,-3.81; 9 3.81,-1.27; 10 3.81,1.27; 11 3.81,3.81; 12 3.81,6.35
1X04 = drill 1.016 pad 1.88: 1 0,0; 2 2.54,0; 3 5.08,0; 4 7.62,0
SO16 = smd 0.6 x 2.2: 1 -4.445,-2.6; 2 -3.175,-2.6; 3 -1.905,-2.6; 4 -0.635,-2.6; 5 0.635,-2.6; 6 1.905,-2.6; 7 3.175,-2.6; 8 4.445,-2.6; 9 4.445,2.6; 10 3.175,2.6; 11 1.905,2.6; 12 0.635,2.6; 13 -0.635,2.6; 14 -1.905,2.6; 15 -3.175,2.6; 16 -4.445,2.6
1X03 = drill 1.016 pad 1.88: 1 0,0; 2 2.54,0; 3 5.08,0
B1,27 = smd 1.27 x 1.27: TP 0,0
KLJ-1230 = smd 0.9 x 1.8: + -5.85,0; - 5.85,0
SOT457R_PHILIPS = smd 0.55 x 0.8: 1 -0.95,-1.2; 2 0,-1.2; 3 0.95,-1.2; 4 0.95,1.2; 5 0,1.2; 6 -0.95,1.2
BATTERY_HOLDER_18650 = drill 0.6 square: + 36.11,0; - -36.11,0 | hole 3.55: -27.6,-8; 27.6,8 | hole 2.39: 36.11,-7.1
USB_MICRO_B = smd 0.4 x 1.05: D+ 0,0; D- -0.65,0; GND 1.3,0; ID 0.65,0; VBUS -1.3,0 | drill 1.7: P$6 -4.85,-0.325; P$7 4.85,-0.325; P$8 -4.85,-3.625; P$9 4.85,-3.625
DFN12 = smd 0.7 x 0.25: 1 -1.35,1.125; 2 -1.35,0.675; 3 -1.35,0.225; 4 -1.35,-0.225; 5 -1.35,-0.675; 6 -1.35,-1.125; 7 1.35,-1.125; 8 1.35,-0.675; 9 1.35,-0.225; 10 1.35,0.225; 11 1.35,0.675; 12 1.35,1.125 | smd 1.6 x 2.5: 13 0,0

### Placement (x,y rotation side)
A  69.81,16 0 top
ACC  25.41,31.1 0 top
B  11.61,23.7 0 top
C1  27.01,8.1 270 top
C2  17.27,10 270 top
C3  73.41,26.3 0 top
C4  28.61,5.5 270 top
C5  31.06,2.4 180 top
C6  10.48,17.12 180 top
C7  10.47,11.88 180 top
C8  7.61,19.73 90 top
C9  14.31,10.62 180 top
C10  14.31,19.7 90 top
C11  16.41,19.7 90 top
C12  49.43,3.56 270 top
C13  50.51,17.2 270 top
C17  28.61,9.3 90 top
C18  30.96,12.19 0 top
C20  8.31,8.5 0 top
CHARGE  23.61,9.6 0 top
D  60.71,24.1 0 top
D1  51.91,15.82 90 top
DUAL_MOSFET  71.41,28.8 180 top
FTDI  52.26,37.62 90 top
GREEN  25.58,17.3 90 top
J1  19.51,10.6 270 top
J2  45.91,20.1 0 top
L1  10.87,18.85 0 top
L2  49.92,8.85 0 top
LDO  31.01,5.1 180 top
LDO_MCU  31.01,9.7 0 top
LED1  55.89,50.8 315 top
LED2  58.43,50.8 315 top
LED3  60.97,50.8 315 top
LED4  63.51,50.8 315 top
LED5  66.05,50.8 315 top
LED6  68.59,50.8 315 top
LED7  71.13,50.8 315 top
LED8  55.89,48.26 315 top
LED9  58.43,48.26 315 top
LED10  60.97,48.26 315 top
LED11  63.51,48.26 315 top
LED12  66.05,48.26 315 top
LED13  68.59,48.26 315 top
LED14  71.13,48.26 315 top
LED15  55.89,45.72 315 top
LED16  58.43,45.72 315 top
LED17  60.97,45.72 315 top
LED18  63.51,45.72 315 top
LED19  66.05,45.72 315 top
LED20  68.59,45.72 315 top
LED21  71.13,45.72 315 top
LED22  55.89,43.18 315 top
LED23  58.43,43.18 315 top
LED24  60.97,43.18 315 top
LED25  63.51,43.18 315 top
LED26  66.05,43.18 315 top
LED27  68.59,43.18 315 top
LED28  71.13,43.18 315 top
LED29  55.89,40.64 315 top
LED30  58.43,40.64 315 top
LED31  60.97,40.64 315 top
LED32  63.51,40.64 315 top
LED33  66.05,40.64 315 top
LED34  68.59,40.64 315 top
LED35  71.13,40.64 315 top
MCU  40.01,44 0 top
PROTECT  71.41,32.5 180 top
PWR  40.31,17.6 0 top
Q1  31.91,17.32 180 top
R  23.51,23.8 0 top
R1  22.71,14.8 90 top
R2  24.51,14.8 90 top
R3  12.99,12.85 270 top
R4  12.98,15.96 90 top
R5  17.27,6.92 270 top
R6  69.41,26.3 0 top
R7  72.31,35 0 top
R8  19.61,23.8 180 top
R9  56.86,24.07 180 top
R10  65.71,16.1 0 top
R11  7.81,23.6 0 top
R12  48.91,17.2 90 top
R13  46.91,15.3 90 top
R14  55.89,38.1 45 top
R15  58.43,38.1 45 top
R16  60.97,38.1 45 top
R17  63.51,38.1 45 top
R18  66.05,38.1 45 top
R19  68.59,38.1 45 top
R20  71.13,38.1 45 top
R21  5.31,37.7 270 top
R22  3.31,37.7 270 top
R23  9.28,37.7 270 top
R24  7.31,37.7 270 top
R25  17.75,37.7 270 top
R26  20.3,37.71 270 top
R27  22.81,37.66 270 top
R28  76.01,32.4 270 top
R30  34.41,19.23 270 top
R31  29.41,17.2 270 top
R32  31.85,20.01 0 top
R33  47.56,3.54 270 top
R34  18.88,16.45 270 top
R35  46.71,18 180 top
R36  27.05,11.1 90 top
R37  8.31,6.4 180 top
RED  21.67,17.3 270 top
RIGHT_EYE  16.48,45.67 90 top
SEN  64.01,7.5 0 top
SHIFT1  15.93,31.92 180 top
SHIFT2  40.01,26.5 0 top
SHIFT3  60.96,31.94 180 top
STEP-UP  49.81,13.9 180 top
SV1  54.91,17.3 0 top
SV2  54.91,14.1 0 top
SV3  54.91,10.8 0 top
SV4  54.91,7.5 0 top
TP1  18.71,18.8 0 top
TP4  6.25,17.39 0 top
TP5  20.07,14.05 0 top
TP6  3.79,28.2 0 top
TP7  44.11,20.4 0 top
TP8  33.41,1.9 0 top
TP9  28.75,22.02 0 top
TP10  50.85,4.46 0 top
TP11  39.46,21.66 0 top
TP12  45.03,14.74 0 top
TP13  26.47,13.55 0 top
U$1  40.21,7 0 top
U$2  10.43,14.44 0 top
U$3  39.91,30.1 0 bottom
USB  5.38,14.71 270 top
USB-TTL  15.89,14.39 90 top

### Tracks (layer width: path | path; a pad name or v marks a point on that pad's centre or on a via)
3V3  (via drill 0.35)
  Top 0.152: 20.37,27.74 20.41,27.7
  Top 0.254: LDO.5 | 34.11,0.8 47.61,0.8 | 47.61,0.8 50.01,0.8 51.81,2.6 51.81,4.5 52.79,5.49 53.81,5.49 72.13,5.5 73.23,6.7 73.23,11.6 71.53,13.3 67.81,13.3 | 12.81,30.9 18.14,30.9 18.44,30.54 18.44,27.99 18.72,27.7 20.41,27.7 22.11,27.7 22.31,27.9 22.31,29.1 | SHIFT1.16 | v43.17,27.57 43.18,27.59 SHIFT2.10 43.18,30.32 43.01,30.5 35.7,30.5 35.56,30.37 SHIFT2.16 | 22.31,29.1 22.31,32.6 22.81,33.1 ACC.1 | A.4 | SHIFT3.16 65.36,29.3 65.36,20.54 67.84,18.07 67.84,13.33 67.81,13.3 | 67.81,13.3 66.91,13.3 | 66.91,13.3 64.64,13.3 64.04,13.9 64.04,19.1 61.81,21.32 59.98,21.32 59.43,21.87 56.41,21.87 55.96,22.32 R9.2 56.01,24.11 56.01,26 56.02,26 v56.02,27.56 57.32,27.56 57.77,28.02 57.77,29.33 SHIFT3.10 | R33.2 47.61,2.6 47.61,0.8 | A.3 66.91,14.47 66.91,13.3 | ACC.6 22.31,29.1 | SHIFT1.16 20.41,29.28 | SHIFT1.16 20.37,27.74 | SHIFT1.10 12.81,29.38 12.81,30.9 | 12.81,30.9 9.51,30.9 5.62,27 5.62,25.3 v6.11,24.8 | R8.2 v18.71,22.7 | B.4 15.41,22.2 v15.91,22.7 | B.3 9.71,22.2 v10.21,22.7
  Bottom 0.254: v56.02,27.56 43.2,27.6 v43.17,27.57
  Bottom 0.508: v6.11,24.8 8.21,22.7 v10.21,22.7 v15.91,22.7 v18.71,22.7 22.71,22.7 25.22,20.19 25.22,9.69 28.6,6.31 30.9,6.31 v33.41,3.8
  pour Top (no thermals): 31.41,4.63 31.41,0.8 34.71,0.8 34.71,7.8 34.03,7.79 34.03,5.49 33.11,4.6
3V3_MCU  (via drill 0.35)
  Top 0.254: LDO_MCU.5 C18.1 30.01,12.19 v30.01,13.3 | MCU.2 31.98,49.73 32.31,49.4 32.31,33.57 30.63,31.89 30.63,22.74 30.37,22.42 30.27,22.34 v30.01,22 29.26,22 TP9.TP
  Bottom 0.254: v30.01,13.3 v30.01,22
5V
  Top 0.254: SV1.2 57.45,16.9 | 40.26,20.4 PWR.5
  pour Top (rank 2, no thermals): 56.28,6.25 58.61,6.15 58.61,18 58.11,18.6 54.19,18.74 50.33,22.5 39.11,22.5 39.11,19.5 41.64,19.53 41.63,21.71 48.63,21.71 49.74,20.82 49.79,19.04 51.96,19.02 52.71,18.2 52.61,6.2 56.18,6.2
  pour Top (no thermals): 56.41,9.6 68.01,9.6 69.91,9.6 72.51,9.6 72.51,6.6 70.71,6.6 70.71,8.8 56.41,8.8
ACC_ENABLE
  Top 0.254: ACC.7 25.41,28 25.71,27.7 28.74,27.7 28.94,27.9 28.94,33.63 28.94,33.64 28.94,36.45 29.52,37.03 MCU.12
ACC_INT1
  Top 0.254: ACC.8 28.04,29.1 28.53,29.6 28.53,33.47 28.52,33.48 28.52,37.6 29.22,38.3 MCU.11
ACC_INT2
  Top 0.254: ACC.9 27.72,29.9 28.12,30.3 28.12,32.89 28.12,32.9 28.12,38.9 28.11,38.9 28.78,39.57 MCU.10
ACC_MISO
  Top 0.254: MCU.9 28.55,40.84 27.71,40 27.71,39.07 27.71,32.6 27.41,32.3 ACC.12
ACC_MOSI
  Top 0.254: ACC.13 26.51,33.6 27.3,34.39 27.3,40.16 27.31,40.17 27.31,41.3 28.12,42.11 MCU.8
ACC_SCK  (via drill 0.35)
  Top 0.254: ACC.14 25.66,33.45 25.66,33.49 26.9,34.73 26.9,42.29 28.01,43.4 v28.71,43.4 | v48.31,37 49.23,37 MCU.27
  Bottom 0.254: v28.71,43.4 32.71,43.4 39.11,37 v48.31,37
BUTTON-A
  Top 0.254: R10.2 66.75,16.24 66.75,17.64 A.1 66.84,17.55 66.84,18.49 64.91,20.42 64.91,26.78 64.09,27.6 60.21,27.6 59.65,28.16 59.65,31.18 59.31,31.52 56.33,31.52 55.01,30.2 51.01,30.2 50.61,30.6 50.61,35.4 50.31,35.7 49.32,35.7 MCU.26
BUTTON-B
  Top 0.254: MCU.14 30.76,33.16 29.81,32.21 29.81,27.52 29.17,26.89 19.04,26.89 18.89,26.89 18.71,26.89 15.35,26.89 14.54,26.07 B.2 | B.1 8.69,23.62 R11.2
BUZZER
  Top 0.254: R30.1 34.41,20.8 31.88,23.33 31.88,29.2 34.28,31.6 35.27,31.6 35.58,31.91 MCU.16
D+
  Top 0.254: USB.D+ 4.33,14.71 3.91,14.3 3.91,12.4 4.41,11.9 8.11,11.9 8.31,12.1 8.31,13.77 8.94,14.4 10.61,14.4 11.27,15.06 | 11.27,15.06 R4.1 | 11.27,15.06 11.27,15.52 U$2.4 C6.1
D-
  Top 0.254: USB.D- 4.27,15.37 3.51,14.6 3.51,12.23 4.24,11.5 8.31,11.5 8.71,11.9 8.71,13.6 9.11,14 11.41,14 | 11.41,14 12.74,14 R3.1 | 11.41,14 11.38,13.97 U$2.3 11.38,11.89 C7.1
DOWNLOAD
  Top 0.254: R9.1 57.78,24.77 D.1 57.81,25.62 57.81,27.23 58.36,27.78 58.36,30.56 58.2,30.72 56.1,30.72 55.18,29.8 50.68,29.8 49.26,31.22 MCU.25
ECHO  (via drill 0.35)
  Top 0.254: MCU.29 47.52,39.57 47.32,39.38 47.32,31.44 50.73,28.04 50.73,25.84 55.99,20.58 59,20.58 59.47,20.11 61.31,20.11 62.82,18.6 62.82,10.69 v63.31,10.2
  Bottom 0.254: v63.31,10.2 66.01,7.5 SEN.2
GND  (via drill 0.35)
  Top 0.254: D.4 v63.71,21.3 | R10.1 v64.81,17.5 | v36.61,46.4 36.61,49.9 35.71,51 MCU.1 | MCU.38 49.16,50.9 44.81,50.9 44.01,50.1 v44.01,46.4 | MCU.GND v38.31,45.3 | MCU.15 33.41,32.7 33.11,32.4 v33.11,31.7 | SHIFT3.8 55.86,34.54 v55.46,35.14 | SHIFT2.8 v45.41,23.9 | SHIFT1.8 10.55,34.52 v10.53,34.55 | CHARGE.3 24.24,8.47 v23.84,8.78 | C1.2 v27.01,6.1 | LDO.2 v31.01,5.1 | C4.2 v28.61,3.6 | C5.2 v29.15,2.4 | C17.2 28.61,10.7 28.88,10.97 v29.21,10.97 | LDO_MCU.2 v31.01,9.7 | C12.2 v49.43,1.64 | CHARGE.1 21.71,6.2 v20.81,6.2 | ACC.5 v23.31,29.9 | ACC.4 v23.31,30.7 v23.3,30.7 | ACC.2 v23.32,32.3 | R32.1 30.95,20.7 v31.35,21.07 | R7.2 v74.31,35 | R13.1 46.93,13.4 v46.93,13.3 | C13.2 50.61,16.2 | v31.85,13.29 v31.86,13.29 C18.2 | R31.2 30.61,16.3 v30.81,16.1 | R37.1 v10.21,6.4 | C20.2 v10.16,8.5 | C8.2 8.79,20.62 v8.81,20.6 | C10.2 v13.21,20.6 | C11.2 v17.61,20.6 | R5.1 v16.12,7.82 v16.11,7.81 | C2.2 v16.12,9.1 | C6.2 8.67,17.12 v8.66,17.11 | C7.2 9.55,11.86 v9.55,10.76 | C9.2 v12.49,10.62 | USB-TTL.13 16.42,14.39 16.57,14.24 USB-TTL.5 | v16.71,14.4 v16.7,14.39 USB-TTL.13 | U$2.2 v10.43,10.77 v10.42,10.76 | USB-TTL.13 v15.21,14.4 | R.4 27.44,23.3 v27.91,23.3 | R.3 19.61,22.3 19.41,22.1 v19.41,21.6 | R11.1 6.21,23.6 v5.81,23.2
  other vias: 66.55,29.05 39.71,45.3 41.11,45.3 42.41,45.3 42.41,44 41.11,44 39.71,44 38.41,44 38.41,42.7 38.41,41.4 39.71,41.4 41.11,41.4 42.41,41.4 42.41,42.6 41.11,42.7 39.71,42.7 76.01,34.2 49.81,13.8 77.41,34.2 77.41,33.3 67.66,29.03 67.09,28.46 4.87,12.73 5.81,12.73 6.71,12.73 6.71,13.63 6.71,14.54
  pour Bottom (rank 2, no thermals): 0.11,47.4 80.01,47.4 80.01,0 0.01,0 0.01,50.6
  pour Top (no thermals): 51.11,16.66 49.8,16.64 49.8,15.5 49.51,15.5 49.5,15.49 49.5,13.59 50.11,13.6 50.11,16 51.11,16
  pour Top (no thermals): 75.41,32.9 75.41,34.7 78.01,34.7 78.01,32.9
  pour Top (no thermals): 68.91,28.22 66.21,28.22 66.21,29.37 68.91,29.37
  pour Top (no thermals): 5.99,13.57 4.51,13.57 4.51,12.5 4.71,12.3 7.01,12.3 7.31,12.6 7.31,15 6.21,15 6.21,13.8
LC1
  Top 0.254: SHIFT3.7 57.78,35.84 57.03,36.6 56.12,36.6 R14.1
LC2
  Top 0.254: SHIFT3.6 59.05,36.2 R15.1
LC3
  Top 0.254: SHIFT3.5 60.32,35.88 59.81,36.4 59.81,36.94 R16.1
LC4
  Top 0.254: SHIFT3.4 61.59,36.19 R17.1
LC5
  Top 0.254: SHIFT3.3 62.86,35.76 64.11,37 64.95,37 R18.1
LC6
  Top 0.254: SHIFT3.2 64.14,35.83 64.71,36.4 66.89,36.4 R19.1
LC7
  Top 0.254: SHIFT3.1 65.41,35.7 65.61,35.9 68.93,35.9 R20.1
LEDS_ENABLE  (via drill 0.35)
  Top 0.254: SHIFT2.13 39.38,27.64 v39.56,27.45 | v16.56,27.89 16.56,28.65 16.51,28.7 16.51,29.27 SHIFT1.13 | v61.55,30.95 61.55,29.39 SHIFT3.13 | v50.49,44.65 MCU.33
  Bottom 0.254: v16.56,27.89 16.74,27.7 27.88,27.7 28.01,27.7 30.71,24.9 37.01,24.9 v39.56,27.45 44.43,32.22 50.71,32.21 | 50.71,32.21 59.89,32.2 60.3,32.2 v61.55,30.95 | 50.71,32.21 50.49,32.43 v50.49,44.65
LEDS_RCK  (via drill 0.35)
  Top 0.254: SHIFT2.12 40.64,27.77 v40.96,27.45 | SHIFT1.12 v15.29,27.84 15.29,27.68 | v60.31,30.9 60.31,29.36 SHIFT3.12 | MCU.36 50.25,48.46 50.78,48.99 52.76,48.99 53.51,48.25 v53.51,31.52
  Bottom 0.254: v15.29,27.84 15.84,27.3 27.77,27.29 30.61,24.4 37.91,24.4 v40.96,27.45 45.03,31.52 v53.51,31.52 59.69,31.52 v60.31,30.9
LEDS_SCK  (via drill 0.35)
  Top 0.254: SHIFT2.11 41.91,27.8 v42.2,27.51 | v14,27.84 14,29.3 SHIFT1.11 | 59.07,29.33 SHIFT3.11 59.07,29.36 v59.07,30.94 | v54.11,30.94 54.09,30.96 54.09,31.76 53.91,31.93 53.91,50.38 52.76,51.53 51.76,51.53 51.04,50.82 51.04,50.43 50.31,49.7 49.29,49.7 MCU.37
  Bottom 0.254: v14,27.84 15.04,26.89 27.59,26.87 30.38,23.98 38.69,24 v42.2,27.51 45.63,30.94 v54.11,30.94 v59.07,30.94
LEDS_SIN
  Top 0.254: MCU.13 29.8,35.76 29.34,35.3 29.34,33.8 29.34,28.42 29.34,27.63 29.01,27.3 29,27.3 18.88,27.3 18.88,27.29 18.72,27.3 18.55,27.3 18.43,27.42 17.83,28.02 SHIFT1.14
LR1  (via drill 0.35)
  Top 0.254: LED1.A 55.88,50.79 v55.9,50.79 | v58.41,50.8 57.69,50.08 LED2.A | v60.99,50.78 60.95,50.78 LED3.A | v63.51,50.8 LED4.A | v66.01,50.8 65.31,50.1 LED5.A | v68.6,50.79 68.58,50.79 LED6.A | v71.12,50.81 70.39,50.08 LED7.A | SHIFT2.7 43.21,23.93 43.21,25.2 43.31,25.3 45.61,25.3 v46.21,24.7
  Bottom 0.254: v55.9,50.79 v58.4,50.79 v58.41,50.8 60.97,50.8 v60.99,50.78 63.49,50.78 v63.51,50.8 v66.01,50.8 v68.59,50.8 v68.6,50.79 71.1,50.79 v71.11,50.8 | v71.11,50.8 v71.12,50.81 | v46.21,24.7 46.45,24.7 46.5,24.65 57.89,24.65 60.82,27.58 63.08,27.58 63.79,28.3 63.81,28.3 72.71,37.2 72.71,37.22 74.38,38.89 74.41,38.89 75.12,39.6 75.12,42 73.22,43.91 73.22,50.39 72.81,50.8 v71.11,50.8
LR2  (via drill 0.35)
  Top 0.254: LED8.A 55.88,48.25 v55.88,48.27 | v58.4,48.29 58.4,48.23 LED9.A | v60.97,48.26 LED10.A | v63.49,48.28 62.77,47.56 LED11.A | v66.06,48.25 65.33,47.52 LED12.A | v68.58,48.27 68.58,48.25 LED13.A | v71.1,48.29 71.1,48.23 LED14.A | SHIFT2.6 41.91,25.2 42.41,25.7 46.27,25.7 v46.74,25.23
  Bottom 0.254: v55.88,48.27 58.38,48.27 v58.4,48.29 60.94,48.29 v60.97,48.26 63.47,48.26 v63.49,48.28 66.03,48.28 v66.06,48.25 68.56,48.25 v68.58,48.27 71.08,48.27 v71.1,48.29 v71.11,48.3 72.31,48.3 72.81,47.8 72.81,43.74 74.72,41.84 74.72,39.77 74.25,39.29 74.22,39.29 62.91,27.99 60.66,27.99 57.85,25.18 47.03,25.18 46.98,25.23 v46.74,25.23
LR3  (via drill 0.35)
  Top 0.254: LED15.A 55.87,45.7 v55.91,45.7 | v58.43,45.72 LED16.A | v61,45.69 60.94,45.69 LED17.A | v63.51,45.7 62.79,44.98 LED18.A | v66.09,45.68 65.39,44.98 LED19.A | v68.61,45.7 68.57,45.7 LED20.A | v71.11,45.7 LED21.A | SHIFT2.5 40.64,25.23 41.52,26.11 46.92,26.11 v47.27,25.76
  Bottom 0.254: v55.91,45.7 55.93,45.72 v58.43,45.72 60.97,45.72 v61,45.69 v63.5,45.69 v63.51,45.7 66.07,45.7 v66.09,45.68 66.11,45.7 v68.61,45.7 v71.11,45.7 72.11,45.7 72.41,45.4 72.41,43.57 74.31,41.67 74.31,39.93 74.08,39.7 74.05,39.7 62.74,28.39 60.49,28.39 57.81,25.71 47.56,25.71 47.52,25.76 v47.27,25.76
LR4  (via drill 0.35)
  Top 0.254: LED22.A v55.89,43.18 | v58.46,43.15 57.75,42.44 LED23.A | v60.98,43.17 60.25,42.44 LED24.A | v63.5,43.19 62.77,42.46 LED25.A | v66.07,43.16 65.35,42.44 LED26.A | v68.59,43.18 LED27.A | LED27.A | v71.11,43.2 70.39,42.48 LED28.A | SHIFT2.4 39.38,25.21 40.68,26.51 47.34,26.51 47.56,26.29 v47.8,26.29
  Bottom 0.254: v55.89,43.18 58.43,43.18 v58.46,43.15 60.96,43.15 v60.98,43.17 63.48,43.17 v63.5,43.19 66.04,43.19 v66.07,43.16 68.57,43.16 v68.59,43.18 71.09,43.18 v71.11,43.2 72.21,43.2 73.91,41.5 73.91,40.1 73.88,40.1 62.58,28.8 60.32,28.8 57.82,26.29 v47.8,26.29
LR5  (via drill 0.35)
  Top 0.254: LED29.A 55.85,40.6 v55.91,40.6 | v58.44,40.63 57.71,39.9 LED30.A | v60.96,40.65 60.23,39.92 LED31.A | v63.51,40.6 62.81,39.9 LED32.A | v66.1,40.59 65.41,39.9 LED33.A | v68.61,40.6 67.91,39.9 LED34.A | v71.14,40.63 70.41,39.9 LED35.A | SHIFT3.15 64.14,31.12 68.51,35.5 69.77,35.5 73.33,39.06 v73.33,40.67
  Bottom 0.254: v55.91,40.6 58.41,40.6 v58.44,40.63 60.94,40.63 v60.96,40.65 63.46,40.65 v63.51,40.6 v66.09,40.6 v66.1,40.59 v68.6,40.59 v68.61,40.6 71.11,40.6 | 71.11,40.6 v71.14,40.63 | v73.33,40.67 73.26,40.6 71.11,40.6
N$1
  Top 0.254: C13.1 | 47.71,18.1 R35.1 47.61,17.1 47.51,17 46.32,17 46.03,16.71 46.03,15.64 TP12.TP
  pour Top (no thermals): 51.55,16.02 52.27,16.02 52.27,18.05 51.71,18.6 47.11,18.6 47.11,17.4 51.56,17.39
N$2  (via drill 0.35)
  Top 0.254: v33.17,15.91 31.92,15.91 Q1.3 | v34.59,10.01 37.59,7 U$1.-
  Bottom 0.254: v34.59,10.01 33.15,11.45 v33.17,15.91
  pour Top (no thermals): 46.43,7.85 45.7,7.85 45.71,4.1 48.11,4.1 48.11,4.78 46.43,4.78
N$3
  Top 0.254: USB-TTL.1 14.77,12.21 14.51,11.95 R3.2
N$4
  Top 0.254: CHARGE.7 22.98,13.63 R1.1
N$5
  Top 0.254: R4.2 14.52,16.86 14.77,16.61 USB-TTL.12
N$6  (via drill 0.35)
  Top 0.254: USB-TTL.3 USB-TTL.2 v15.22,11.8 15.22,10.63 C9.1 | USB-TTL.9 16.12,16.25 v16.41,16.54
  Bottom 0.254: v15.22,11.8 15.22,11.84 16.13,12.76 16.13,14.64 16.41,14.92 v16.41,16.54
N$7
  Top 0.254: CHARGE.6 24.24,13.63 R2.1
N$8
  Top 0.254: R1.2 RED.C
N$9
  Top 0.254: R2.2 24.52,15.71 GREEN.C
N$10
  Top 0.254: CHARGE.2 22.98,5.76 22.81,5.6 18.51,5.6 18.09,6.02 R5.2
N$11
  Top 0.254: 32.86,19.79 R32.2 32.86,19.7 Q1.1 32.86,18.34 R30.2 34.39,18.12
N$12
  Top 0.254: PROTECT.2 R7.1
N$13
  pour Top (no thermals): 71.65,31.81 71.21,31.8 71.21,26.9 70.01,26.9 70.01,25.7 72.86,25.71 72.86,26.91 71.65,26.91
N$14
  Top 0.254: DUAL_MOSFET.4 74.29,32.73 73.56,33.65 PROTECT.1
N$15
  Top 0.254: DUAL_MOSFET.5 68.54,32.73 69.46,33.65 PROTECT.3
N$18
  Top 0.254: STEP-UP.3 48.86,16.25 R12.1 47.01,16.3 R13.2
N$19
  pour Top (no thermals): 50.56,15.56 50.57,14.48 51.46,14.48 51.46,5.98 52.91,6 52.91,15.59
N$20  (via drill 0.35)
  Top 0.254: SHIFT2.14 v38.1,27.41 v38.11,27.4 | v11.49,27.72 SHIFT1.9
  Bottom 0.254: v38.11,27.4 38.11,26.8 36.71,25.4 31.01,25.4 29.81,26.6 28.21,28.2 17.06,28.2 16.8,28.46 13.67,28.46 12.91,27.7 11.51,27.7 v11.49,27.72
N$21  (via drill 0.35)
  Top 0.254: SHIFT2.9 44.55,29.2 v45.51,29.2 | v62.86,31 SHIFT3.14
  Bottom 0.254: v45.51,29.2 62.41,29.2 62.91,29.7 62.86,29.75 v62.86,31
N$22
  Top 0.254: TP13.TP 26.47,13.15 CHARGE.5
  pour Top (no thermals): 27.51,8.6 27.51,11.2 26.17,11.2 26.17,13.3 25.31,13.3 25.31,11 26.41,9.9 26.41,8.6
N$23
  Top 0.254: R37.2 C20.1 6.61,8.51 5.25,9.87 USB.P$7
  Bottom 0.508: USB.P$6 USB.P$8 USB.P$9 USB.P$7
N$30
  Top 0.254: R21.1 5.31,42.63 10.58,47.9 11.51,47.9 12.67,49.06 RIGHT_EYE.11
N$31
  Top 0.254: R22.1 3.31,41.2 10.13,48.02 RIGHT_EYE.12
N$32
  Top 0.254: LED1.C 56.63,50.24 56.56,50.17 56.56,49.94 56.63,49.87 LED8.C 56.63,47.7 56.56,47.63 56.56,47.4 56.63,47.33 LED15.C 56.63,45.16 56.56,45.09 56.56,44.86 56.63,44.79 LED22.C 56.63,42.62 56.56,42.55 56.56,42.32 56.63,42.25 LED29.C 56.63,40.08 56.56,40.01 56.56,38.77 R14.2
N$33
  Top 0.254: R15.2 59.07,41.28 LED30.C 59.17,42.25 59.1,42.32 59.1,42.55 59.17,42.62 LED23.C 59.17,44.79 59.1,44.86 59.1,45.09 59.17,45.16 LED16.C 59.17,47.33 59.1,47.4 59.1,47.63 59.17,47.7 LED9.C 59.17,49.87 59.1,49.94 59.1,50.17 59.17,50.24 LED2.C
N$34
  Top 0.254: LED3.C 61.71,50.24 61.64,50.17 61.64,49.94 61.71,49.87 LED10.C 61.71,47.7 61.64,47.63 61.64,47.4 61.71,47.33 LED17.C 61.71,45.16 61.64,45.09 61.64,44.86 61.71,44.79 LED24.C 61.71,42.62 61.64,42.55 61.64,42.32 61.71,42.25 LED31.C 61.61,41.28 R16.2
N$35
  Top 0.254: R17.2 64.15,41.28 LED32.C 64.25,42.25 64.18,42.32 64.18,42.55 64.25,42.62 LED25.C 64.25,44.79 64.18,44.86 64.18,45.09 64.25,45.16 LED18.C 64.25,47.33 64.18,47.4 64.18,47.63 64.25,47.7 LED11.C 64.25,49.87 64.18,49.94 64.18,50.17 64.25,50.24 LED4.C
N$36
  Top 0.254: LED5.C 66.79,50.24 66.72,50.17 66.72,49.94 66.79,49.87 LED12.C 66.79,47.7 66.72,47.63 66.72,47.4 66.79,47.33 LED19.C 66.79,45.16 66.72,45.09 66.72,44.86 66.79,44.79 LED26.C 66.79,42.62 66.72,42.55 66.72,42.32 66.79,42.25 LED33.C 66.79,40.08 66.72,40.01 66.72,38.77 R18.2
N$37
  Top 0.254: R19.2 69.23,41.28 LED34.C 69.33,42.25 69.26,42.32 69.26,42.55 69.33,42.62 LED27.C 69.33,44.79 69.26,44.86 69.26,45.09 69.33,45.16 LED20.C 69.33,47.33 69.26,47.4 69.26,47.63 69.33,47.7 LED13.C 69.33,49.87 69.26,49.94 69.26,50.17 69.33,50.24 LED6.C
N$38
  Top 0.254: LED7.C LED14.C LED21.C LED28.C LED35.C 71.77,41.28 R20.2
N$39
  Top 0.254: R24.1 7.31,44.06 10.75,47.5 11.68,47.5 15.91,47.5 17.75,49.34 RIGHT_EYE.9
N$40
  Top 0.254: R23.1 9.31,38.63 9.31,39.3 11.87,41.86 RIGHT_EYE.2
N$41
  Top 0.254: RIGHT_EYE.4 17.73,41.85 17.75,41.83 R25.1
N$42
  Top 0.254: R26.1 20.3,41.85 RIGHT_EYE.5
N$43
  Top 0.254: 22.85,41.85 RIGHT_EYE.6 22.81,41.84 R27.1
N$62
  Top 0.254: 72.37,31.14 PROTECT.6 | 73.61,28.48 DUAL_MOSFET.2
  pour Top (no thermals): 76.61,31.9 75.41,31.9 75.41,29.3 72.61,29.3 72.61,31.8 72.16,31.8 72.16,28.32 75.02,28.32 75.02,26.9 73.91,26.9 73.91,25.7 76.61,25.71
N$63
  Top 0.254: Q1.2 30.77,18.23 30.64,18.1 R31.1
PULSE  (via drill 0.35)
  Top 0.254: MCU.28 47.96,38.3 47.73,38.06 47.73,31.61 51.13,28.2 51.13,26 56.15,20.98 59.17,20.98 59.64,20.52 61.48,20.52 63.23,18.77 63.23,11.28 v64.31,10.2
  Bottom 0.254: v64.31,10.2 65.31,9.2 67.41,9.2 69.09,7.52 SEN.3
RC1
  Top 0.254: SHIFT1.4 16.56,32.44 16.01,31.89 6.17,31.89 5.31,32.74 R21.2 5.4,36.71
RC2
  Top 0.254: SHIFT1.3 17.83,32.82 16.49,31.48 6.33,31.48 3.78,31.48 3.29,31.96 3.29,36.78 R22.2
RC3
  Top 0.254: SHIFT1.7 12.75,33.24 12.61,33.1 9.8,33.1 9.28,33.62 R23.2
RC4
  Top 0.254: SHIFT1.5 15.29,32.57 15.01,32.29 8.06,32.29 7.31,33.04 R24.2
RC5
  Top 0.254: SHIFT1.2 19.1,36.51 18.81,36.8 18.8,36.8 R25.2
RC6
  Top 0.254: SHIFT1.1 20.37,36.74 R26.2
RC7
  Top 0.254: SHIFT1.15 19.1,30.79 22.81,34.5 R27.2
RESET
  Top 0.254: MCU.3 31.65,48.46 31.91,48.2 31.91,33.74 30.21,32.04 30.21,26.18 29.33,25.3 R.2 | R.1 20.59,23.88 R8.1
RR1
  Top 0.254: SHIFT1.6 14.02,33.01 13.71,32.7 9.11,32.7 8.31,33.5 8.31,40.04 RIGHT_EYE.1
RR2  (via drill 0.35)
  Top 0.254: SHIFT2.1 35.56,26.34 35.4,26.51 33.84,26.51 32.69,27.66 32.69,27.72 v32.51,27.9
  Bottom 0.254: v32.51,27.9 20.11,40.3 15.71,40.3 15.21,40.8 RIGHT_EYE.3
RR3  (via drill 0.35)
  Top 0.254: SHIFT2.2 36.84,25.98 35.89,26.91 34.19,26.91 33.46,27.65 33.46,27.71 v33.27,27.89
  Bottom 0.254: v33.27,27.89 33.09,28.08 33.09,28.14 20.43,40.8 16.71,40.8 16.41,41.1 16.41,48.3 16.01,48.7 16,48.7 RIGHT_EYE.10
RR4  (via drill 0.35)
  Top 0.254: v34.79,27.91 34.97,27.91 35.15,27.72 36.73,27.72 36.84,27.82 SHIFT2.15
  Bottom 0.254: v34.79,27.91 34.61,28.08 34.61,28.12 21.71,41.02 21.71,48.37 RIGHT_EYE.7
RR5  (via drill 0.35)
  Top 0.254: v34.03,27.89 34.21,27.71 34.21,27.67 34.56,27.32 36.06,27.32 38.1,25.28 SHIFT2.3
  Bottom 0.254: v34.03,27.89 33.85,28.07 33.85,28.13 21.31,40.67 21.31,48.47 RIGHT_EYE.8
RX  (via drill 0.35)
  Top 0.254: 31.46,22.01 | 31.46,22.01 31.47,22.02 31.48,31.56 33.7,33.78 45.79,33.78 46.11,34.1 46.11,45.75 46.29,45.93 MCU.34 51.58,45.92 FTDI.4 | 31.46,22.01 29.45,20 v20.41,20 | USB-TTL.7 v17.02,17.19 v17.01,17.2
  Bottom 0.254: v17.01,17.2 17.01,18.4 18.61,20 v20.41,20
SERVO1
  Top 0.254: MCU.23 44.47,31.54 44.91,31.1 45.38,31.1 49.11,27.37 49.11,25.17 55.32,18.96 58.34,18.96 SV1.3
SERVO2
  Top 0.254: MCU.24 45.74,31.31 49.52,27.54 49.52,25.34 55.48,19.37 58.5,19.37 58.97,18.9 60.81,18.9 61.61,18.1 61.61,15.8 59.99,14.18 SV2.3
SERVO3
  Top 0.254: MCU.31 46.71,42.11 46.52,41.91 46.52,31.11 49.92,27.7 49.92,25.5 55.65,19.77 58.67,19.77 59.14,19.3 60.98,19.3 62.01,18.27 62.01,15.63 62.01,12.8 61.99,12.8 SV3.3
SERVO4  (via drill 0.35)
  Top 0.254: MCU.30 47.1,40.84 46.92,40.66 46.92,31.27 50.33,27.87 50.33,25.67 55.82,20.18 58.84,20.18 59.31,19.71 61.14,19.71 62.42,18.43 62.42,12.64 62.41,12.63 v62.41,10.2
  Bottom 0.254: v62.41,10.2 62.41,9.92 SV4.3
TX  (via drill 0.35)
  Top 0.254: FTDI.5 51.67,47.19 MCU.35 45.95,47.19 45.71,46.94 45.71,34.3 45.59,34.18 33.53,34.18 31.07,31.72 31.07,22.23 29.36,20.5 20.73,20.5 20.65,20.58 20.63,20.58 v20.41,20.8 | USB-TTL.10 v15.67,17.17
  Bottom 0.254: v15.67,17.17 16.61,18.11 16.61,18.57 18.44,20.4 20,20.4 20.17,20.58 20.19,20.58 v20.41,20.8
USB-FILTERED  (via drill 0.35)
  Top 0.254: USB-TTL.4 16.12,12.59 v16.51,12.2
  Bottom 0.254: v16.51,12.2 17.61,12.2 17.91,12.5 v17.91,18.1
  pour Top (no thermals): 11.29,19.45 11.29,18.25 17.21,18.3 18.23,16.8 19.45,16.8 19.44,19.45
USB-RAW
  Top 0.254: U$2.5 10.43,15.12 10.21,14.9 8.74,14.9 TP4.TP
  pour Top (no thermals): 4.91,15.9 4.91,18.4 5.91,19.4 10.31,19.4 10.31,18.3 8.91,18.3 6.51,15.9
VBAT  (via drill 0.35)
  Top 0.254: v67.51,26.3 R6.1 | TP6.TP U$3.+
  Bottom 0.254: v42.81,17.2 48.91,17.2 54.21,22.5 63.71,22.5 v67.51,26.3
  Bottom 2.54: 43.15,17.74 42.81,17.4 v42.81,17.2 v42.81,16.4 42.81,15.3 35.49,7.98 29.3,7.98 26.89,10.39 26.89,11.81 27.55,12.47 27.55,12.99 27.82,13.09 27.71,13.2 27.71,20.5 23.71,24.5 20.51,24.5 18.21,24.5 9.4,24.5 U$3.+
  other vias: 27.41,12.76 28.12,13.21 28.77,12.76 28.13,12.23 42.81,18
  pour Bottom (no thermals): 26.51,11.6 29.11,11.6 29.11,14.14 26.51,14.13
  pour Top (no thermals): 26.58,11.62 29.32,11.62 29.31,13.49 27.41,13.49 arc-90 26.58,12.66
  pour Top (no thermals): 43.41,13.8 42.21,13.8 42.21,18.4 43.41,18.4
VCC
  Top 0.254: 40.16,14.6 PWR.2
  pour Top (no thermals): 39.81,15.7 39.81,9.4 46.91,9.4 46.91,6 48.81,6 48.81,3.8 50.93,3.79 50.93,11.88 50.11,11.91 50.11,13.1 48.61,13.1 48.61,11.9 42.92,11.89 42.41,11.89 40.81,13.5 40.82,15.69
  pour Top (no thermals): 28.01,8.9 28.01,5.9 30.31,5.9 30.31,7.1 31.71,7.1 31.71,5.9 33.61,5.9 33.61,10.73 40.81,10.73 40.81,13.49 32.61,13.49 32.61,8.9 31.71,8.9 31.71,7.7 30.31,7.7 30.31,8.9
VSTEPUP
  pour Top (no thermals): 42.31,21.3 46.41,21.3 46.41,17.4 44.21,17.4 44.21,19.46 42.31,19.46
VUSB
  Top 0.254: 37.76,14.7 PWR.1
  pour Top (no thermals): 21.91,9.4 18.21,9.4 18.21,16.2 20.06,16.2 20.09,19.27 21.73,19.27 21.7,19.28 27.4,19.28 27.41,16 28.21,15.12 34.22,15.16 36.41,17.4 36.41,21.3 38.31,21.3 38.31,13.9 27.51,13.9 26.91,14.54 21.91,14.54
  pour Top (no thermals): 25.81,5.9 25.21,5.9 25.21,8.6 24.41,9.4 18.21,9.4 18.21,10.2 16.61,10.2 16.61,11.5 18.21,11.5 18.21,10.8 24.91,10.8 25.81,9.9

### Text on the board
tNames: DNF | Fri3d Camp 2018 | Badge prototype 2 | DNF